# EAGLE schematic untitled (EAGLE 8.4.3)
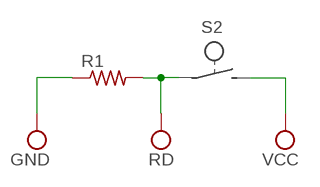
[diagram p0: schematic, sheet 1]

## Parts
R1  R-US_0204/7  [0204/7]

## Nets
VDD: R1.1 R1.2 ; supply symbol labelled GND, RD, VCC

## Library data of the parts
R1 = rcl:R-US_: RESISTOR, American symbol